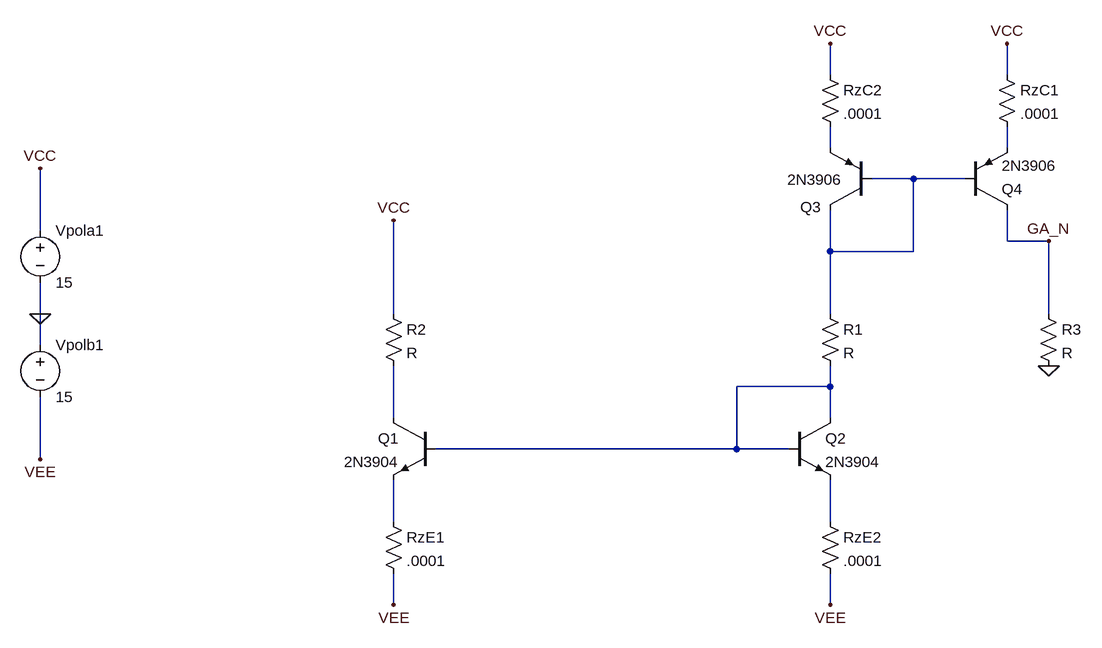
[diagram p0: schematic LT_Mirror.asc]
LT_Mirror.asc, the LTspice schematic file:
Version 4
SHEET 1 880 680
WIRE 288 -544 288 -592
WIRE 560 -544 560 -592
WIRE 288 -432 288 -464
WIRE 560 -432 560 -464
WIRE 416 -384 352 -384
WIRE 496 -384 416 -384
WIRE -928 -304 -928 -400
WIRE 560 -288 560 -336
WIRE 624 -288 560 -288
WIRE 288 -272 288 -336
WIRE 416 -272 416 -384
WIRE 416 -272 288 -272
WIRE -928 -176 -928 -224
WIRE -384 -176 -384 -320
WIRE 288 -176 288 -272
WIRE 624 -176 624 -288
WIRE -928 -128 -928 -176
WIRE 288 -64 288 -96
WIRE 288 -64 144 -64
WIRE -384 -16 -384 -96
WIRE 288 -16 288 -64
WIRE 144 32 144 -64
WIRE 144 32 -320 32
WIRE 224 32 144 32
WIRE -928 48 -928 -48
WIRE -384 144 -384 80
WIRE 288 144 288 80
WIRE -384 272 -384 224
WIRE 288 272 288 224
FLAG -384 272 VEE
FLAG 288 272 VEE
FLAG 560 -592 VCC
FLAG 624 -288 GA_N
FLAG 288 -592 VCC
FLAG 624 -96 0
FLAG -928 -400 VCC
FLAG -928 48 VEE
FLAG -928 -176 0
FLAG -384 -320 VCC
SYMBOL res -400 128 R0
SYMATTR InstName RzE1
SYMATTR Value .0001
SYMBOL npn -320 -16 M0
SYMATTR InstName Q1
SYMATTR Value 2N3904
SYMBOL npn 224 -16 R0
SYMATTR InstName Q2
SYMATTR Value 2N3904
SYMBOL res 272 128 R0
SYMATTR InstName RzE2
SYMATTR Value .0001
SYMBOL res 544 -560 R0
SYMATTR InstName RzC1
SYMATTR Value .0001
SYMBOL res 272 -560 R0
SYMATTR InstName RzC2
SYMATTR Value .0001
SYMBOL pnp 352 -336 R180
WINDOW 0 78 4 Left 2
WINDOW 3 45 47 Left 2
SYMATTR InstName Q3
SYMATTR Value 2N3906
SYMBOL pnp 496 -336 M180
SYMATTR InstName Q4
SYMATTR Value 2N3906
SYMBOL res 272 -192 R0
SYMATTR InstName R1
SYMBOL res -400 -192 R0
SYMATTR InstName R2
SYMBOL res 608 -192 R0
SYMATTR InstName R3
SYMBOL voltage -928 -320 R0
WINDOW 123 0 0 Left 0
WINDOW 39 0 0 Left 0
SYMATTR InstName Vpola1
SYMATTR Value 15
SYMBOL voltage -928 -144 R0
WINDOW 123 0 0 Left 0
WINDOW 39 0 0 Left 0
SYMATTR InstName Vpolb1
SYMATTR Value 15

The netlist it stands for:
* LT_Mirror.asc
RzE1 N006 VEE .0001
Q1 N005 N004 N006 0 2N3904
Q2 N004 N004 N007 0 2N3904
RzE2 N007 VEE .0001
RzC1 VCC N002 .0001
RzC2 VCC N001 .0001
Q3 N003 N003 N001 0 2N3906
Q4 GA_N N003 N002 0 2N3906
R1 N003 N004 R
R2 VCC N005 R
R3 GA_N 0 R
Vpola1 VCC 0 15
Vpolb1 0 VEE 15
.model NPN NPN
.model PNP PNP
.lib standard.bjt
.backanno
.end